# Altium schematic sheet Peripherals.SchDoc
size A4; SheetNumber: 7; SheetTotal: 7
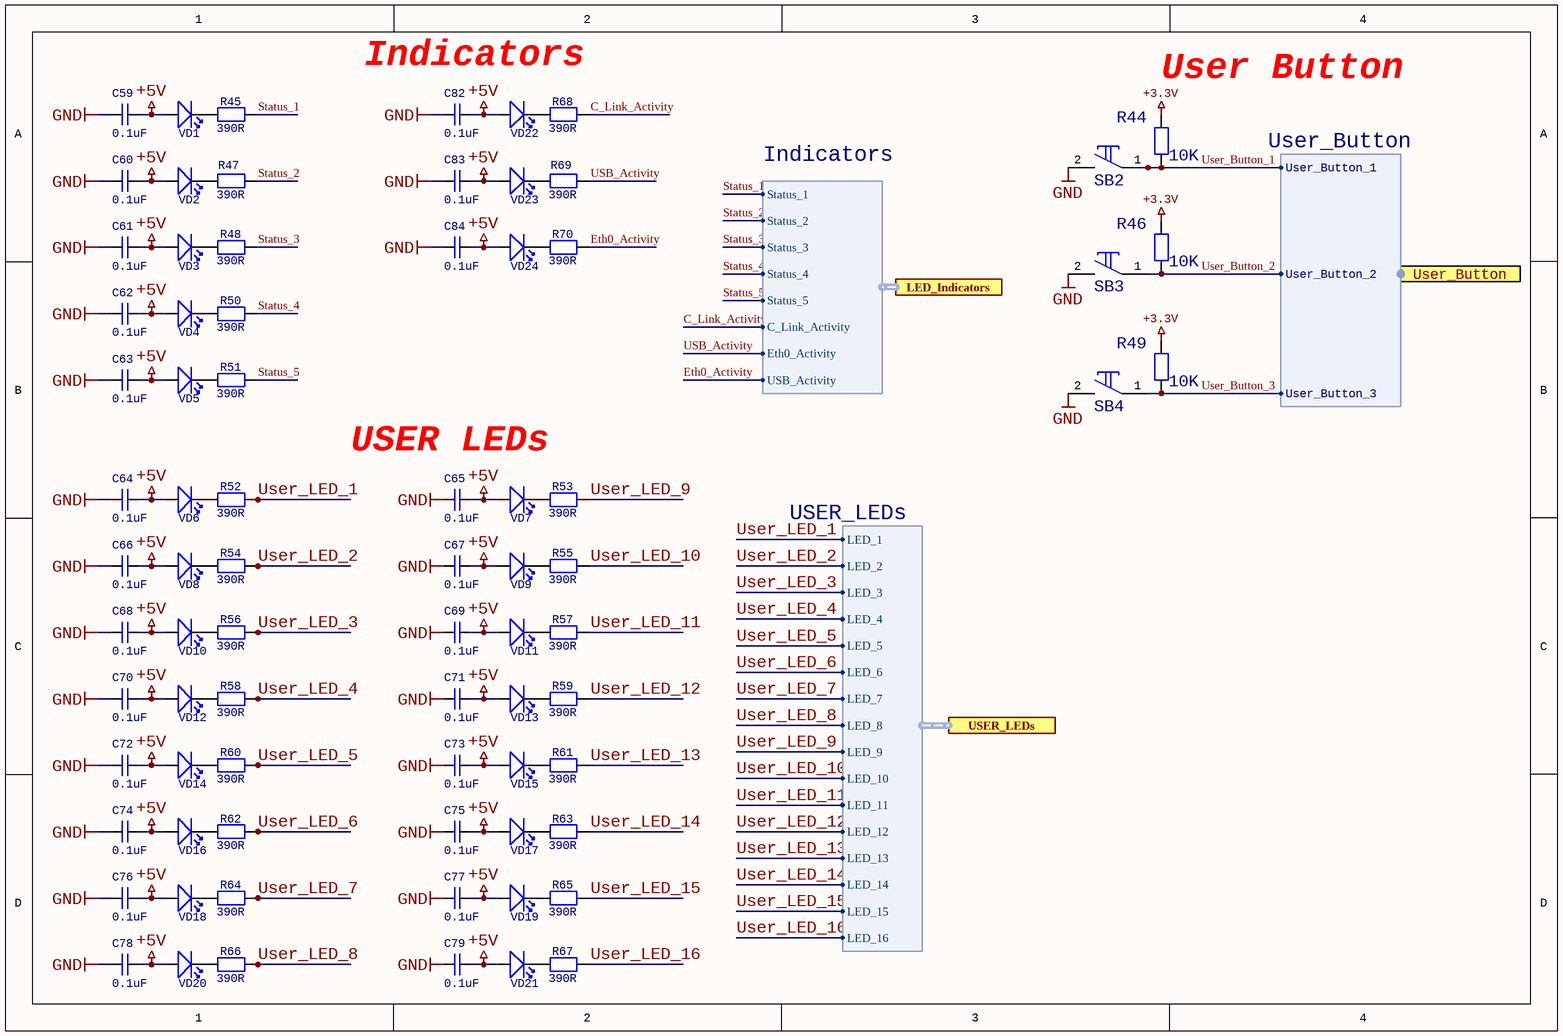
[diagram p0: Peripherals.SchDoc]

## Parts
C59  0.1uF  [C_0603]
C60  0.1uF  [C_0603]
C61  0.1uF  [C_0603]
C62  0.1uF  [C_0603]
C63  0.1uF  [C_0603]
C64  0.1uF  [C_0603]
C65  0.1uF  [C_0603]
C66  0.1uF  [C_0603]
C67  0.1uF  [C_0603]
C68  0.1uF  [C_0603]
C69  0.1uF  [C_0603]
C70  0.1uF  [C_0603]
C71  0.1uF  [C_0603]
C72  0.1uF  [C_0603]
C73  0.1uF  [C_0603]
C74  0.1uF  [C_0603]
C75  0.1uF  [C_0603]
C76  0.1uF  [C_0603]
C77  0.1uF  [C_0603]
C78  0.1uF  [C_0603]
C79  0.1uF  [C_0603]
C82  0.1uF  [C_0603]
C83  0.1uF  [C_0603]
C84  0.1uF  [C_0603]
R44  10K  [R_0805]
R45  390R  [R_0603]
R46  10K  [R_0805]
R47  390R  [R_0603]
R48  390R  [R_0603]
R49  10K  [R_0805]
R50  390R  [R_0603]
R51  390R  [R_0603]
R52  390R  [R_0603]
R53  390R  [R_0603]
R54  390R  [R_0603]
R55  390R  [R_0603]
R56  390R  [R_0603]
R57  390R  [R_0603]
R58  390R  [R_0603]
R59  390R  [R_0603]
R60  390R  [R_0603]
R61  390R  [R_0603]
R62  390R  [R_0603]
R63  390R  [R_0603]
R64  390R  [R_0603]
R65  390R  [R_0603]
R66  390R  [R_0603]
R67  390R  [R_0603]
R68  390R  [R_0603]
R69  390R  [R_0603]
R70  390R  [R_0603]
SB2  Text  [DTS-32]  (value not drawn)
SB3  Text  [DTS-32]  (value not drawn)
SB4  Text  [DTS-32]  (value not drawn)
VD1  LED  [LD0805]  (value not drawn)
VD2  LED  [LD0805]  (value not drawn)
VD3  LED  [LD0805]  (value not drawn)
VD4  LED  [LD0805]  (value not drawn)
VD5  LED  [LD0805]  (value not drawn)
VD6  LED  [LD0805]  (value not drawn)
VD7  LED  [LD0805]  (value not drawn)
VD8  LED  [LD0805]  (value not drawn)
VD9  LED  [LD0805]  (value not drawn)
VD10  LED  [LD0805]  (value not drawn)
VD11  LED  [LD0805]  (value not drawn)
VD12  LED  [LD0805]  (value not drawn)
VD13  LED  [LD0805]  (value not drawn)
VD14  LED  [LD0805]  (value not drawn)
VD15  LED  [LD0805]  (value not drawn)
VD16  LED  [LD0805]  (value not drawn)
VD17  LED  [LD0805]  (value not drawn)
VD18  LED  [LD0805]  (value not drawn)
VD19  LED  [LD0805]  (value not drawn)
VD20  LED  [LD0805]  (value not drawn)
VD21  LED  [LD0805]  (value not drawn)
VD22  LED  [LD0805]  (value not drawn)
VD23  LED  [LD0805]  (value not drawn)
VD24  LED  [LD0805]  (value not drawn)

## Ports
LED_Indicators (harness Indicators), User_Button (harness User_Button), USER_LEDs (harness USER_LEDs)

## Harnesses
USER_LEDs: LED_1, LED_2, LED_3, LED_4, LED_5, LED_6, LED_7, LED_8, LED_9, LED_10, LED_11, LED_12, LED_13, LED_14, LED_15, LED_16
User_Button: User_Button_1, User_Button_2, User_Button_3
Indicators: Eth0_Activity, USB_Activity, C_Link_Activity, Status_5, Status_4, Status_3, Status_2, Status_1

## Nets
+3.3V: R44.1 R46.1 R49.1
+5V: C59.2 C60.2 C61.2 C62.2 C63.2 C64.2 C65.2 C66.2 C67.2 C68.2 C69.2 C70.2 C71.2 C72.2 C73.2 C74.2 C75.2 C76.2 C77.2 C78.2 C79.2 C82.2 C83.2 C84.2 VD1.1(+) VD2.1(+) VD3.1(+) VD4.1(+) VD5.1(+) VD6.1(+) VD7.1(+) VD8.1(+) VD9.1(+) VD10.1(+) VD11.1(+) VD12.1(+) VD13.1(+) VD14.1(+) VD15.1(+) VD16.1(+) VD17.1(+) VD18.1(+) VD19.1(+) VD20.1(+) VD21.1(+) VD22.1(+) VD23.1(+) VD24.1(+)
GND: C59.1 C60.1 C61.1 C62.1 C63.1 C64.1 C65.1 C66.1 C67.1 C68.1 C69.1 C70.1 C71.1 C72.1 C73.1 C74.1 C75.1 C76.1 C77.1 C78.1 C79.1 C82.1 C83.1 C84.1 SB2.2 SB3.2 SB4.2
C_Link_Activity: R68.2 ; port LED_Indicators.C_Link_Activity
Eth0_Activity: R70.2 ; port LED_Indicators.USB_Activity
Status_1: R45.2 ; port LED_Indicators.Status_1
Status_2: R47.2 ; port LED_Indicators.Status_2
Status_3: R48.2 ; port LED_Indicators.Status_3
Status_4: R50.2 ; port LED_Indicators.Status_4
Status_5: R51.2 ; port LED_Indicators.Status_5
USB_Activity: R69.2 ; port LED_Indicators.Eth0_Activity
User_Button_1: R44.2 SB2.1 ; port User_Button.User_Button_1
User_Button_2: R46.2 SB3.1 ; port User_Button.User_Button_2
User_Button_3: R49.2 SB4.1 ; port User_Button.User_Button_3
User_LED_1: R52.2 ; port USER_LEDs.LED_1
User_LED_2: R54.2 ; port USER_LEDs.LED_2
User_LED_3: R56.2 ; port USER_LEDs.LED_3
User_LED_4: R58.2 ; port USER_LEDs.LED_4
User_LED_5: R60.2 ; port USER_LEDs.LED_5
User_LED_6: R62.2 ; port USER_LEDs.LED_6
User_LED_7: R64.2 ; port USER_LEDs.LED_7
User_LED_8: R66.2 ; port USER_LEDs.LED_8
User_LED_9: R53.2 ; port USER_LEDs.LED_9
User_LED_10: R55.2 ; port USER_LEDs.LED_10
User_LED_11: R57.2 ; port USER_LEDs.LED_11
User_LED_12: R59.2 ; port USER_LEDs.LED_12
User_LED_13: R61.2 ; port USER_LEDs.LED_13
User_LED_14: R63.2 ; port USER_LEDs.LED_14
User_LED_15: R65.2 ; port USER_LEDs.LED_15
User_LED_16: R67.2 ; port USER_LEDs.LED_16
NetR45_1: R45.1 VD1.2(-)
NetR47_1: R47.1 VD2.2(-)
NetR48_1: R48.1 VD3.2(-)
NetR50_1: R50.1 VD4.2(-)
NetR51_1: R51.1 VD5.2(-)
NetR52_1: R52.1 VD6.2(-)
NetR53_1: R53.1 VD7.2(-)
NetR54_1: R54.1 VD8.2(-)
NetR55_1: R55.1 VD9.2(-)
NetR56_1: R56.1 VD10.2(-)
NetR57_1: R57.1 VD11.2(-)
NetR58_1: R58.1 VD12.2(-)
NetR59_1: R59.1 VD13.2(-)
NetR60_1: R60.1 VD14.2(-)
NetR61_1: R61.1 VD15.2(-)
NetR62_1: R62.1 VD16.2(-)
NetR63_1: R63.1 VD17.2(-)
NetR64_1: R64.1 VD18.2(-)
NetR65_1: R65.1 VD19.2(-)
NetR66_1: R66.1 VD20.2(-)
NetR67_1: R67.1 VD21.2(-)
NetR68_1: R68.1 VD22.2(-)
NetR69_1: R69.1 VD23.2(-)
NetR70_1: R70.1 VD24.2(-)

## Notes on the sheet
- Indicators
- (near R44) User Button
- USER LEDs

## Library data of the parts
C59-C79 C82-C84 = C: Non-polarised capacitor; ComponentLink1Description: Manufacturer Link; ComponentLink1URL: www.murata.com; ComponentLink2Description: Datasheet Link; ComponentLink2URL: http://www.murata.com/products/catalog/pdf/c02e.pdf; ValueSCH: *
R44-R70 = R
SB2-SB4 = Button: Published: 17.04.2014; Publisher: Andrew Danich; Type: Переключатель